# EAGLE design energy-management-driver-175 v2 (EAGLE 6.3)
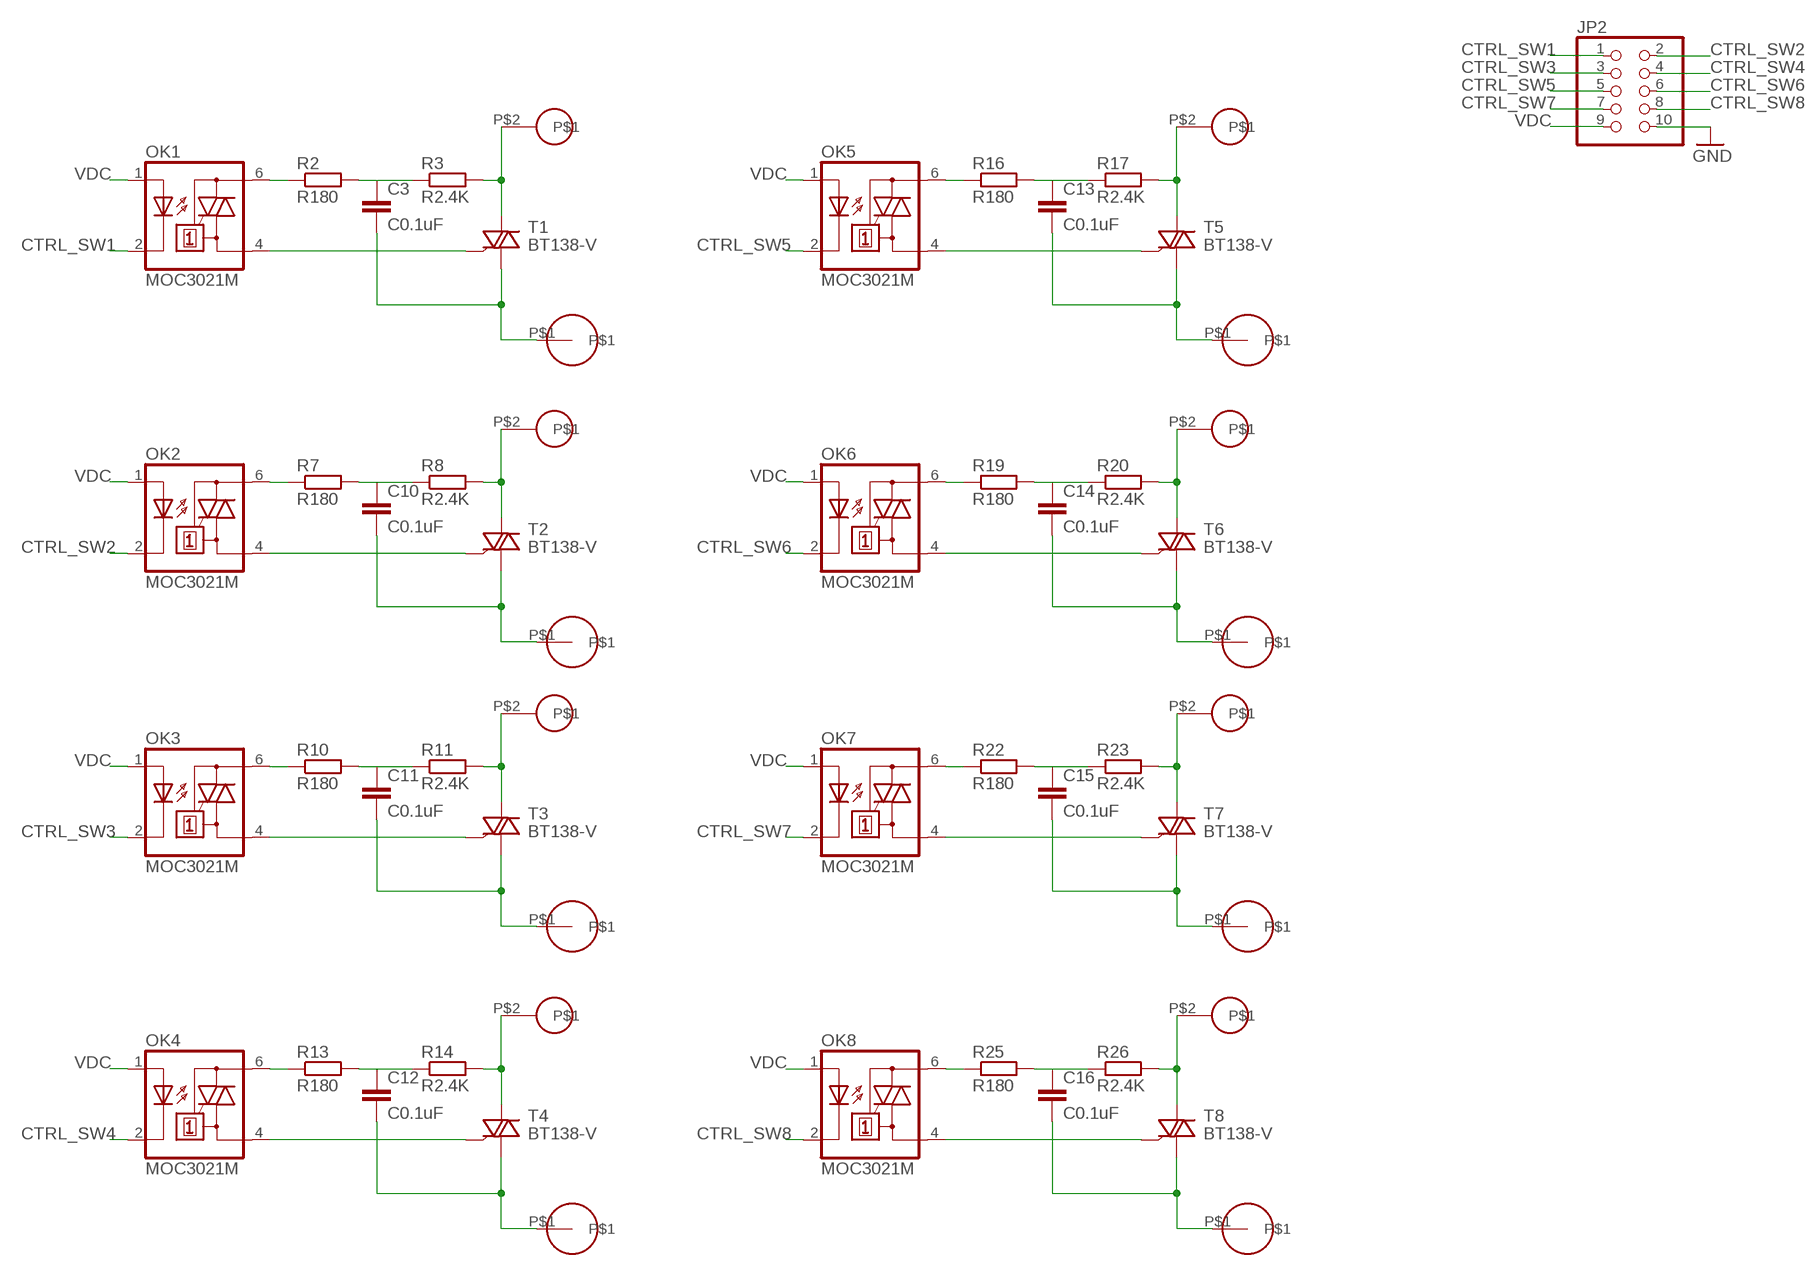
[diagram p0: schematic, sheet 1]

## Parts
C3  C0.1uF  C-EUC0805  [C0805]
C10  C0.1uF  C-EUC0805  [C0805]
C11  C0.1uF  C-EUC0805  [C0805]
C12  C0.1uF  C-EUC0805  [C0805]
C13  C0.1uF  C-EUC0805  [C0805]
C14  C0.1uF  C-EUC0805  [C0805]
C15  C0.1uF  C-EUC0805  [C0805]
C16  C0.1uF  C-EUC0805  [C0805]
JP2  PINHD-2X5  [2X05]
OK1  MOC3021M  [DIL06]
OK2  MOC3021M  [DIL06]
OK3  MOC3021M  [DIL06]
OK4  MOC3021M  [DIL06]
OK5  MOC3021M  [DIL06]
OK6  MOC3021M  [DIL06]
OK7  MOC3021M  [DIL06]
OK8  MOC3021M  [DIL06]
R2  R180  R-EU_M0805  [M0805]
R3  R2.4K  R-EU_M0805  [M0805]
R7  R180  R-EU_M0805  [M0805]
R8  R2.4K  R-EU_M0805  [M0805]
R10  R180  R-EU_M0805  [M0805]
R11  R2.4K  R-EU_M0805  [M0805]
R13  R180  R-EU_M0805  [M0805]
R14  R2.4K  R-EU_M0805  [M0805]
R16  R180  R-EU_M0805  [M0805]
R17  R2.4K  R-EU_M0805  [M0805]
R19  R180  R-EU_M0805  [M0805]
R20  R2.4K  R-EU_M0805  [M0805]
R22  R180  R-EU_M0805  [M0805]
R23  R2.4K  R-EU_M0805  [M0805]
R25  R180  R-EU_M0805  [M0805]
R26  R2.4K  R-EU_M0805  [M0805]
T1  BT138-V  [TO220BV]
T2  BT138-V  [TO220BV]
T3  BT138-V  [TO220BV]
T4  BT138-V  [TO220BV]
T5  BT138-V  [TO220BV]
T6  BT138-V  [TO220BV]
T7  BT138-V  [TO220BV]
T8  BT138-V  [TO220BV]
U$1  CONN-SKUN  [CONN-SKUN]
U$2  CONN-SKUN  [CONN-SKUN]
U$3  CONN-SKUN  [CONN-SKUN]
U$4  CONN-SKUN  [CONN-SKUN]
U$5  CONN-SKUN  [CONN-SKUN]
U$6  CONN-SKUN  [CONN-SKUN]
U$7  CONN-SKUN  [CONN-SKUN]
U$8  CONN-SKUN  [CONN-SKUN]
U$9  CONN-CABLE  [CONN-CABLE]
U$10  CONN-CABLE  [CONN-CABLE]
U$11  CONN-CABLE  [CONN-CABLE]
U$12  CONN-CABLE  [CONN-CABLE]
U$13  CONN-CABLE  [CONN-CABLE]
U$14  CONN-CABLE  [CONN-CABLE]
U$15  CONN-CABLE  [CONN-CABLE]
U$16  CONN-CABLE  [CONN-CABLE]

## Nets
CTRL_SW1: JP2.1 OK1.2(C)
CTRL_SW2: JP2.2 OK2.2(C)
CTRL_SW3: JP2.3 OK3.2(C)
CTRL_SW4: JP2.4 OK4.2(C)
CTRL_SW5: JP2.5 OK5.2(C)
CTRL_SW6: JP2.6 OK6.2(C)
CTRL_SW7: JP2.7 OK7.2(C)
CTRL_SW8: JP2.8 OK8.2(C)
GND: JP2.10
N$3: OK1.6(A2) R2.1
N$4: C3.1 R2.2 R3.1
N$5: OK1.4(A1) T1.G
N$6: C3.2 T1.T1(A1) U$9.P$1
N$9: R3.2 T1.T2(A2) U$1.P$2
N$12: OK2.6(A2) R7.1
N$13: C10.1 R7.2 R8.1
N$14: OK2.4(A1) T2.G
N$15: C10.2 T2.T1(A1) U$11.P$1
N$18: OK3.6(A2) R10.1
N$19: C11.1 R10.2 R11.1
N$20: OK3.4(A1) T3.G
N$21: C11.2 T3.T1(A1) U$14.P$1
N$24: OK4.6(A2) R13.1
N$25: C12.1 R13.2 R14.1
N$26: OK4.4(A1) T4.G
N$27: C12.2 T4.T1(A1) U$13.P$1
N$30: OK5.6(A2) R16.1
N$31: C13.1 R16.2 R17.1
N$32: OK5.4(A1) T5.G
N$33: C13.2 T5.T1(A1) U$10.P$1
N$36: OK6.6(A2) R19.1
N$37: C14.1 R19.2 R20.1
N$38: OK6.4(A1) T6.G
N$39: C14.2 T6.T1(A1) U$12.P$1
N$42: OK7.6(A2) R22.1
N$43: C15.1 R22.2 R23.1
N$44: OK7.4(A1) T7.G
N$45: C15.2 T7.T1(A1) U$15.P$1
N$48: OK8.6(A2) R25.1
N$49: C16.1 R25.2 R26.1
N$50: OK8.4(A1) T8.G
N$51: C16.2 T8.T1(A1) U$16.P$1
N$52: R8.2 T2.T2(A2) U$2.P$2
N$53: R11.2 T3.T2(A2) U$3.P$2
N$54: R14.2 T4.T2(A2) U$4.P$2
N$55: R26.2 T8.T2(A2) U$5.P$2
N$56: R23.2 T7.T2(A2) U$6.P$2
N$57: R20.2 T6.T2(A2) U$7.P$2
N$58: R17.2 T5.T2(A2) U$8.P$2
VDC: JP2.9 OK1.1(A) OK2.1(A) OK3.1(A) OK4.1(A) OK5.1(A) OK6.1(A) OK7.1(A) OK8.1(A)

## Library data of the parts
C3 C10-C16 = resistor:C-EU: CAPACITOR, European symbol
JP2 = pinhead:PINHD-2X5: PIN HEADER
OK1-OK8 = optocoupler:MOC30*M: RANDOM-PHASE OPTOISOLATORS TRIAC DRIVER OUTPUT Source: http://www.fairchildsemi.com MOC3020-M.pdf; MF: FAIRCHILD SEMICONDUCTOR; MPN: MOC3021-M; OC_FARNELL: 1021365; OC_NEWARK: 95B7895
R2 R3 R7 R8 R10 R11 R13 R14 R16 R17 R19 R20 R22 R23 R25 R26 = resistor:R-EU_: RESISTOR, European symbol
T1-T8 = triac:BT138: TRIAC Source: http://www.semiconductors.philips.com BT138_SERIES_2.pdf
U$1-U$8 = bontor:CONN-SKUN
U$9-U$16 = bontor:CONN-CABLE

## Board
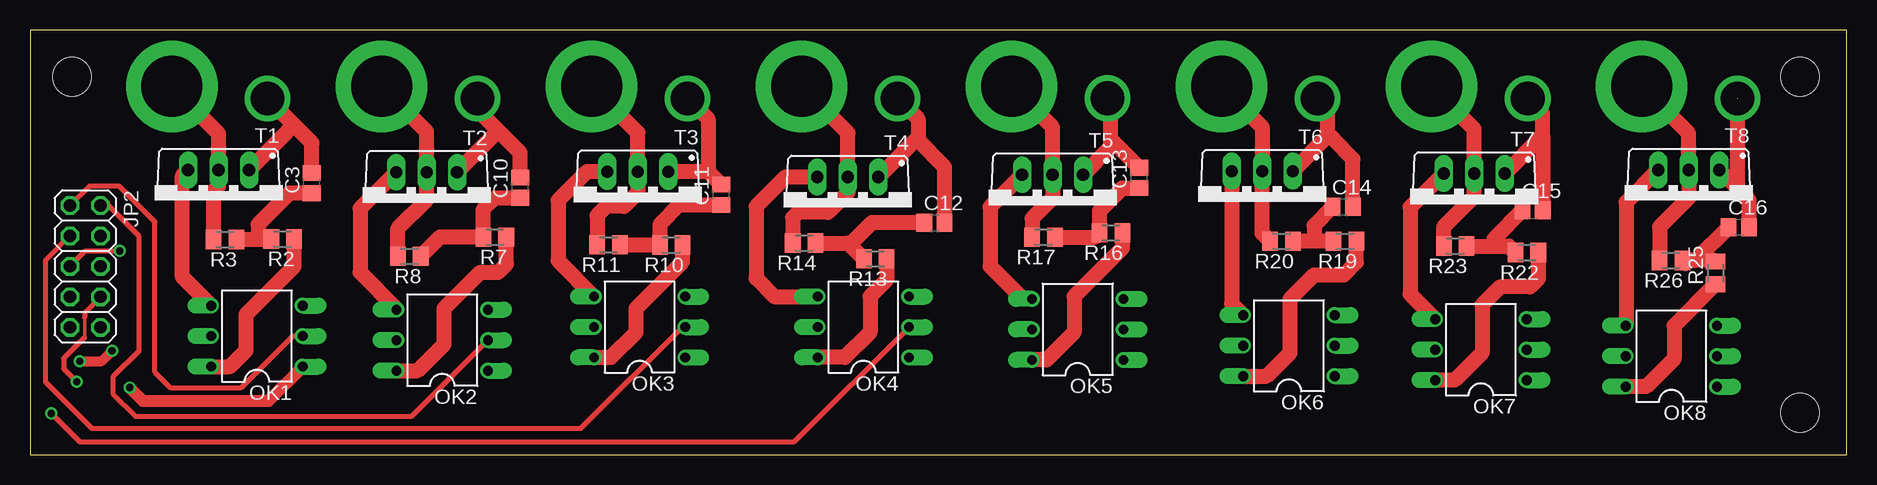
[diagram p1: board, top side]
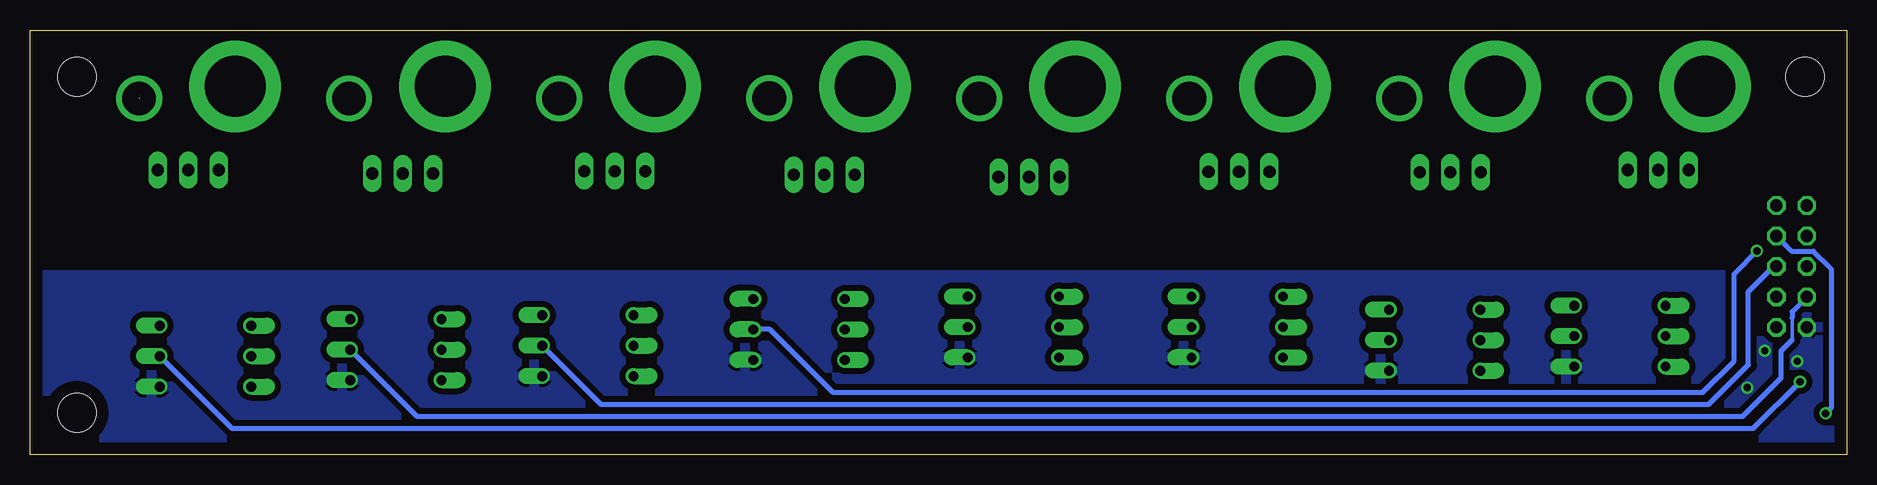
[diagram p2: board, bottom side, seen from below]

Size 151.4 x 35.4 mm. Coordinates in mm from the lower left corner, seen from the top.
Outline: 151.4,0 151.4,35.4 0,35.4 0,0 151.4,0
Copper layers (1*16): Top 0.035mm / dielectric 1.5mm / Bottom 0.035mm
Design rules "default": minimum track width 10mil, minimum drill 24mil, track to track 8mil, track to pad 8mil, pad to pad 8mil, via to via 8mil, smd to smd 8mil, copper to edge 40mil, drill to drill 8mil, minimum pad ring 10mil, minimum via ring 8mil, stop-mask expansion 4mil, vias tented up to drill 0mil, thermal gap 10mil
Holes 3.2 mm at 3.5,31.5 147.5,31.5 147.5,3.5

### Footprints (pad centres in the part's own frame; a part is rotated, then mirrored left to right if it is on the bottom)
C0805 = smd 1.3 x 1.5: 1 -0.85,0; 2 0.85,0
2X05 = drill 1.016 octagon: 1 -5.08,-1.27; 2 -5.08,1.27; 3 -2.54,-1.27; 4 -2.54,1.27; 5 0,-1.27; 6 0,1.27; 7 2.54,-1.27; 8 2.54,1.27; 9 5.08,-1.27; 10 5.08,1.27
DIL06 = drill 0.813 offset: 1 -2.54,-3.81; 2 0,-3.81; 3 2.54,-3.81; 4 2.54,3.81; 5 0,3.81; 6 -2.54,3.81
M0805 = smd 1.3 x 1.6: 1 -0.95,0; 2 0.95,0
TO220BV = drill 1.016 long: G 2.54,-2.54; T1 -2.54,-2.54; T2 0,-2.54
CONN-SKUN = drill 5.08 pad 7.62: P$2 0,0
CONN-CABLE = drill 2.8 pad 3.81: P$1 0,0

### Placement (x,y rotation side)
C3  23.49,22.65 90 top
C10  40.85,22.27 90 top
C11  57.6,21.67 90 top
C12  75.37,19.35 0 top
C13  92.44,23.07 90 top
C14  109.39,20.66 0 top
C15  125.21,20.36 0 top
C16  142.4,18.98 0 top
JP2  4.6,15.7 270 top
OK1  18.91,9.89 90 top
OK2  34.35,9.55 90 top
OK3  50.8,10.65 90 top
OK4  69.45,10.65 90 top
OK5  87.31,10.45 90 top
OK6  104.91,9.09 90 top
OK7  120.91,8.76 90 top
OK8  136.78,8.22 90 top
R2  21.05,17.99 180 top
R3  16.25,17.94 180 top
R7  38.74,18.14 180 top
R8  31.61,16.55 180 top
R10  53.44,17.49 180 top
R11  48.21,17.5 180 top
R13  70.44,16.34 180 top
R14  64.51,17.65 180 top
R16  90.08,18.5 180 top
R17  84.45,18.14 180 top
R19  109.58,17.8 180 top
R20  104.29,17.8 180 top
R22  124.74,16.85 180 top
R23  118.77,17.4 180 top
R25  140.45,15.16 90 top
R26  136.75,16.2 180 top
T1  15.71,21.2 180 top
T2  33.05,21.01 180 top
T3  50.65,21.06 180 top
T4  68.15,20.61 180 top
T5  85.21,20.8 180 top
T6  102.68,21.1 180 top
T7  120.35,20.9 180 top
T8  138.22,21.2 180 top
U$1  11.82,30.7 0 top
U$2  29.3,30.7 0 top
U$3  46.8,30.7 0 top
U$4  64.3,30.7 0 top
U$5  134.3,30.7 0 top
U$6  116.8,30.7 0 top
U$7  99.3,30.7 0 top
U$8  81.8,30.7 0 top
U$9  19.79,29.7 0 top
U$10  89.8,29.71 0 top
U$11  37.3,29.7 0 top
U$12  107.3,29.7 0 top
U$13  72.3,29.7 0 top
U$14  54.8,29.7 0 top
U$15  124.81,29.7 0 top
U$16  142.3,29.7 0 top

### Tracks (layer width: path | path; a pad name or v marks a point on that pad's centre or on a via)
CTRL_SW1
  Top 0.406: OK1.2 21.89,9.89 17.6,5.6 11.7,5.6 10.4,6.9 10.4,19.42 7.4,22.42 4.97,22.42 JP2.1
CTRL_SW2
  Top 0.406: OK2.2 31.81,3.2 8.8,3.2 6.9,5.1 6.9,6.49 9.1,8.69 9.1,18.2 6.52,20.78 JP2.2
CTRL_SW3
  Top 0.406: OK3.2 54.35,10.65 45.9,2.2 5.16,2.2 1.3,6.06 1.3,16.21 JP2.3
CTRL_SW4  (via drill 0.6)
  Top 0.406: OK4.2 63.67,1.07 4.15,1.07 v1.77,3.45
  Bottom 0.406: JP2.4 4.61,16.98 2.79,16.98 1.3,15.49 1.3,3.92 v1.77,3.45
CTRL_SW5  (via drill 0.6)
  Top 0.406: JP2.5 4.62,16.99 v7.49,16.99
  Bottom 0.406: OK5.2 89.75,10.45 84.5,5.2 12,5.2 9.4,7.8 9.4,15.08 v7.49,16.99
CTRL_SW6
  Bottom 0.406: OK6.2 103.83,4.2 11.5,4.2 8.2,7.5 8.2,13.6 6.1,15.7 JP2.6
CTRL_SW7
  Bottom 0.305: 4.55,11.42 4.55,9.6
  Bottom 0.406: OK7.2 119.16,3.2 8.67,3.2 5.5,6.37 5.5,8.65 4.55,9.6 | JP2.7 4.55,11.94 4.55,11.42
CTRL_SW8  (via drill 0.6)
  Top 0.305: 4.56,11.45 4.55,11.44 4.55,9.78
  Top 0.406: JP2.8 4.56,11.85 4.56,11.45 | 4.55,9.78 2.8,8.03 2.8,7.18 v3.9,6.08
  Bottom 0.406: OK8.2 134.57,2.2 7.78,2.2 v3.9,6.08
N$3
  Top 1.27: OK1.6 16.65,7.35 18,8.7 18,11.7 22,15.7 R2.1
N$4
  Top 1.27: R2.2 20.05,17.94 19,17.94 | 19,17.94 R3.1 | C3.1 21.6,21.8 19,19.2 19,17.94
N$5
  Top 1.27: OK1.4 12.7,14.83 12.7,23.27 T1.G
N$6
  Top 1.27: 23.49,24 C3.2 23.49,26 21.75,27.75 | T1.T1 21.38,26.87 arc45 21.75,27.75 | 21.75,27.75 U$9.P$1
N$9
  Top 1.27: T1.T2 15.71,26.77 15.69,26.77 U$1.P$2 | 15.71,23.91 T1.T2 | R3.2 15.3,22 15.71,22.41 T1.T2
N$12
  Top 1.27: OK2.6 32.31,7.01 34.5,9.2 34.5,12.2 37.5,15.2 39,15.2 39.69,15.89 R7.1
N$13
  Top 1.27: C10.1 38.72,21.42 37.79,20.49 R7.2 34.15,18.14 R8.1
N$14
  Top 1.27: T2.G 27.5,20.54 27.5,15.2 30.54,12.16 OK2.4
N$15
  Top 1.27: T2.T1 35.59,23.58 39.02,27.01 | C10.2 40.85,25.18 39.02,27.01 | 39.02,27.01 37.3,28.73 U$11.P$1
N$18
  Top 1.27: OK3.6 48.41,8.11 50.5,10.2 50.5,12.2 54.39,16.09 R10.1
N$19
  Top 1.27: R11.1 R10.2 52.5,19.2 54.12,20.82 C11.1
N$20
  Top 1.27: T3.G 46.4,23.6 44,21.2 44,16.18 OK3.4
N$21
  Top 1.27: C11.2 56.52,23.6 | 56.52,23.6 T3.T1 | U$14.P$1 56.52,27.98 56.52,23.6
N$24
  Top 1.27: R13.1 71.39,14.59 70,13.2 70,10.2 67.91,8.11 OK4.6
N$25
  Top 1.27: R14.1 68.18,17.65 68.31,17.52 | 68.31,17.52 R13.2 | C12.1 70.15,19.35 68.31,17.52
N$26
  Top 1.27: T4.G 62.95,23.15 60.5,20.7 60.5,14.7 62.01,13.19 OK4.4
N$27
  Top 1.27: C12.2 76.22,23.98 74,26.2 74,26.46 | U$13.P$1 74,28 74,26.46 | T4.T1 74,26.46
N$30
  Top 1.27: R16.1 91.03,17.23 87,13.2 87,10.2 84.71,7.91 OK5.6
N$31
  Top 1.27: R17.1 88.77,18.14 R16.2 89.13,20.33 91.02,22.22 C13.1
N$32
  Top 1.27: T5.G 80,20.67 80,15.7 82.71,12.99 OK5.4
N$33
  Top 1.27: C13.2 90.08,26.28 | T5.T1 90.08,25.67 90.08,26.28 | 90.08,26.28 90.08,29.42 U$10.P$1
N$36
  Top 1.27: 110.5,17.77 R19.1 110.53,16.03 109.5,15 107,15 105,13 105,8.5 103.05,6.55 OK6.6
N$37
  Top 1.27: R19.2 107,17.8 | 107,17.8 R20.1 | C14.1 107,19.12 107,17.8
N$38
  Top 1.27: T6.G 100.14,12.59 OK6.4
N$39
  Top 1.27: C14.2 110.24,24.66 108.71,26.22 108.41,26.53 108.11,26.53 | T6.T1 108.11,26.53 | U$12.P$1 108.11,28.89 108.11,26.53
N$42
  Top 1.27: R22.1 125.69,14.69 125,14 122.5,14 121,12.5 121,8.5 118.72,6.22 OK7.6
N$43
  Top 1.27: R23.1 122,17.4 | 122,17.4 123.24,17.4 R22.2 | C15.1 122,18 122,17.4
N$44
  Top 1.27: T7.G 115,20.63 115,13.4 OK7.4
N$45
  Top 1.27: 122.77,23.56 T7.T1 126.06,26.61 | 126.06,26.61 C15.2 | 126.06,26.61 126.06,28.44 U$15.P$1
N$48
  Top 1.27: R25.1 137,10.76 137,8 134.68,5.68 OK8.6
N$49
  Top 1.27: 137.95,15.95 R26.1 138.5,16.2 138.77,16.2 | C16.1 138.77,16.2 | R25.2 140.36,16.2 138.77,16.2
N$50
  Top 1.27: T8.G 133,21.06 133,10.79 OK8.4
N$51  (1 unrouted)
  Top 1.27: C16.2 143.25,21.25 142.25,22.25 | 142.25,22.25 T8.T1 | 142.25,29.7 142.25,22.25
N$52
  Top 1.27: R8.2 30.66,18.86 33.05,21.25 T2.T2 33.05,26.93 30.3,29.68 U$2.P$2
N$53
  Top 1.27: R11.2 47.26,19.96 48,20.7 49.5,20.7 50.65,21.85 T3.T2 50.65,26.86 47.8,29.7 U$3.P$2
N$54
  Top 1.27: R14.2 63.56,19.76 64,20.2 66.5,20.2 68.15,21.85 T4.T2 68.15,26.84 65.3,29.68 U$4.P$2
N$55
  Top 1.27: R26.2 135.8,19 138.22,21.42 T8.T2 138.22,26.78 U$5.P$2
N$56
  Top 1.27: T7.T2 120.35,27.15 U$6.P$2 | T7.T2 120.35,23.05 | R23.2 117.82,19.02 120.35,21.55 T7.T2
N$57
  Top 1.27: R20.2 102.68,18.46 T6.T2 102.68,27.32 100.3,29.7 U$7.P$2
N$58
  Top 1.27: R17.2 83.5,19.7 85.21,21.41 T5.T2 85.21,27.3 82.81,29.7 U$8.P$2
VDC  (via drill 0.6)
  Top 0.813: v4.14,7.8 5.96,7.8 v6.84,8.68
  Top 1.016: v8.3,5.6 9.4,4.5 19.87,4.5 OK1.1
  pour Bottom (isolate 0.5): 1,1.2 150,1 150.5,15 1,15